# EAGLE design joystick (EAGLE 9.5.2)
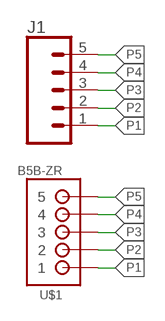
[diagram p0: schematic, sheet 1]

## Parts
J1  CONN_05NO_SILK  [1X05_NO_SILK]
U$1  B5B-ZR  [B5B-ZR]

## Nets
P1: J1.1 U$1.1
P2: J1.2 U$1.2
P3: J1.3 U$1.3
P4: J1.4 U$1.4
P5: J1.5 U$1.5

## Library data of the parts
J1 = SparkFun-Connectors:CONN_05: Multi connection point. Often used as Generic Header-pin footprint for 0.1 inch spaced/style header connections On any of the 0.1 inch spaced packages, you can populate with these: Break Away Headers - Straight <https://www.sparkfun.com/products/116> (PRT-00116) Break Away Male Headers - Right Angle <https://www.sparkfun.com/products/553> (PRT-00553) Female Headers <https://www.sparkfun.com/products/115> (PRT-00115) Break Away Headers - Machine Pin <https://www.sparkfun.com/products/117> (PRT-00117) Break Away Female Headers - Swiss Machine Pin <https://www.sparkfun.com/products/743> (PRT-00743) For SCREWTERMINALS and SPRING TERMINALS visit here: Screw Terimnals on SparkFun.com <https://www.sparkfun.com/search/results?term=Screw+Terminals> (5mm/3.5mm/2.54mm spacing) This device is also useful as a general connection point to wire up your design to another part of your project. Our various solder wires solder well into these plated through hole pads. Hook-Up Wire - Assortment (Stranded, 22 AWG) <https://www.sparkfun.com/products/11375> (PRT-11375) Hook-Up Wire - Assortment (Solid Core, 22 AWG) <https://www.sparkfun.com/products/11367> (PRT-11367) View the entire wire category on our website here <https://www.sparkfun.com/categories/141> Special notes: Molex polarized connector foot print use with SKU : PRT-08231 with associated crimp pins and housings. 1MM SMD Version SKU: PRT-10208
U$1 = jst:B5B-ZR: JST-ZH Connector 5 pol, 1.5mm pitch Package: B5B-ZR Source: http://www.jst-mfg.com/product/pdf/eng/eZH.pdf

## Board
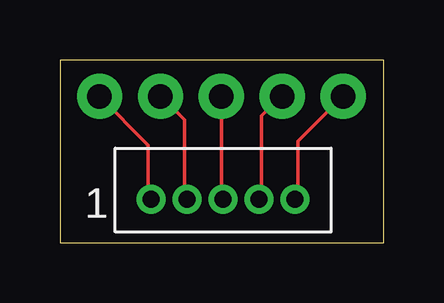
[diagram p1: board, top side]

Size 13.51 x 7.61 mm. Coordinates in mm from the lower left corner, seen from the top.
Outline: 0,0 13.51,0 13.51,7.61 0,7.61 0,0
Copper layers (1*16): Top 0.035mm / dielectric 1.5mm / Bottom 0.035mm
Design rules "default": minimum track width 6mil, minimum drill 0.35mm, track to track 6mil, track to pad 6mil, pad to pad 6mil, via to via 6mil, smd to smd 6mil, copper to edge 40mil, drill to drill 6mil, minimum pad ring 10mil, minimum via ring 8mil, stop-mask expansion 4mil, vias tented up to drill 0mil, thermal gap 10mil

### Footprints (pad centres in the part's own frame; a part is rotated, then mirrored left to right if it is on the bottom)
1X05_NO_SILK = drill 1.016 pad 1.88: 1 0,0; 2 2.54,0; 3 5.08,0; 4 7.62,0; 5 10.16,0
B5B-ZR = drill 0.7: 1 7.5,-1.3; 2 6,-1.3; 3 4.5,-1.3; 4 3,-1.3; 5 1.5,-1.3

### Placement (x,y rotation side)
J1  1.65,6.1 0 top
U$1  11.3,0.51 180 top

### Tracks (layer width: path | path; a pad name or v marks a point on that pad's centre or on a via)
P1
  Top 0.152: J1.1 3.68,4.06 3.68,1.93 U$1.1
P2
  Top 0.152: U$1.2 5.21,1.93 5.21,5.13 4.29,6.05 J1.2
P3
  Top 0.152: J1.3 6.73,1.93 U$1.3
P4
  Top 0.152: U$1.4 8.41,1.93 8.41,5.28 9.17,6.05 J1.4
P5
  Top 0.152: J1.5 9.93,4.22 9.93,1.93 U$1.5

### Text on the board
tNames: 1